# Altium schematic sheet changelog.schdoc
size A4
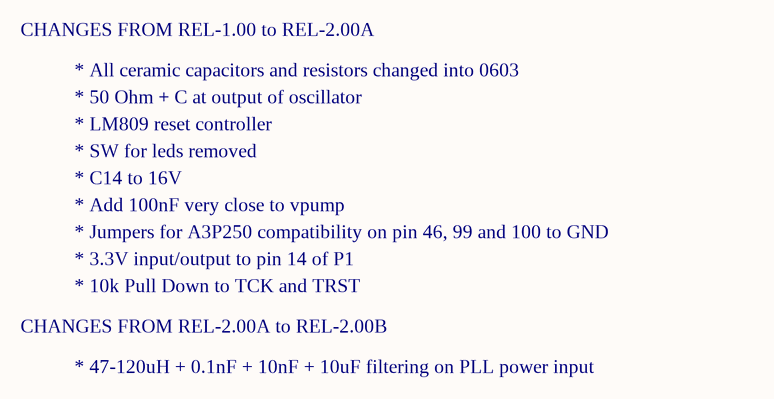
[diagram p0: changelog.schdoc]

## Notes on the sheet
- CHANGES FROM REL-1.00 to REL-2.00A
- * All ceramic capacitors and resistors changed into 0603
- * 50 Ohm + C at output of oscillator
- * LM809 reset controller
- * SW for leds removed
- * C14 to 16V
- * Add 100nF very close to vpump
- * Jumpers for A3P250 compatibility on pin 46, 99 and 100 to GND
- * 3.3V input/output to pin 14 of P1
- * 10k Pull Down to TCK and TRST
- CHANGES FROM REL-2.00A to REL-2.00B
- * 47-120uH + 0.1nF + 10nF + 10uF filtering on PLL power input
- Title
- Size:
- Date:
- A4
- Number:
- Time:
- Revision:
- Sheet
- of
- nbee Embedded Systems S.L.
- AV/Carlos V 45 4-D
- Móstoles (Madrid)
- 28938 SPAIN
- +34 91 1201798
- File: